# Altium project AMPURR.PrjPcb (part 1 of 2)
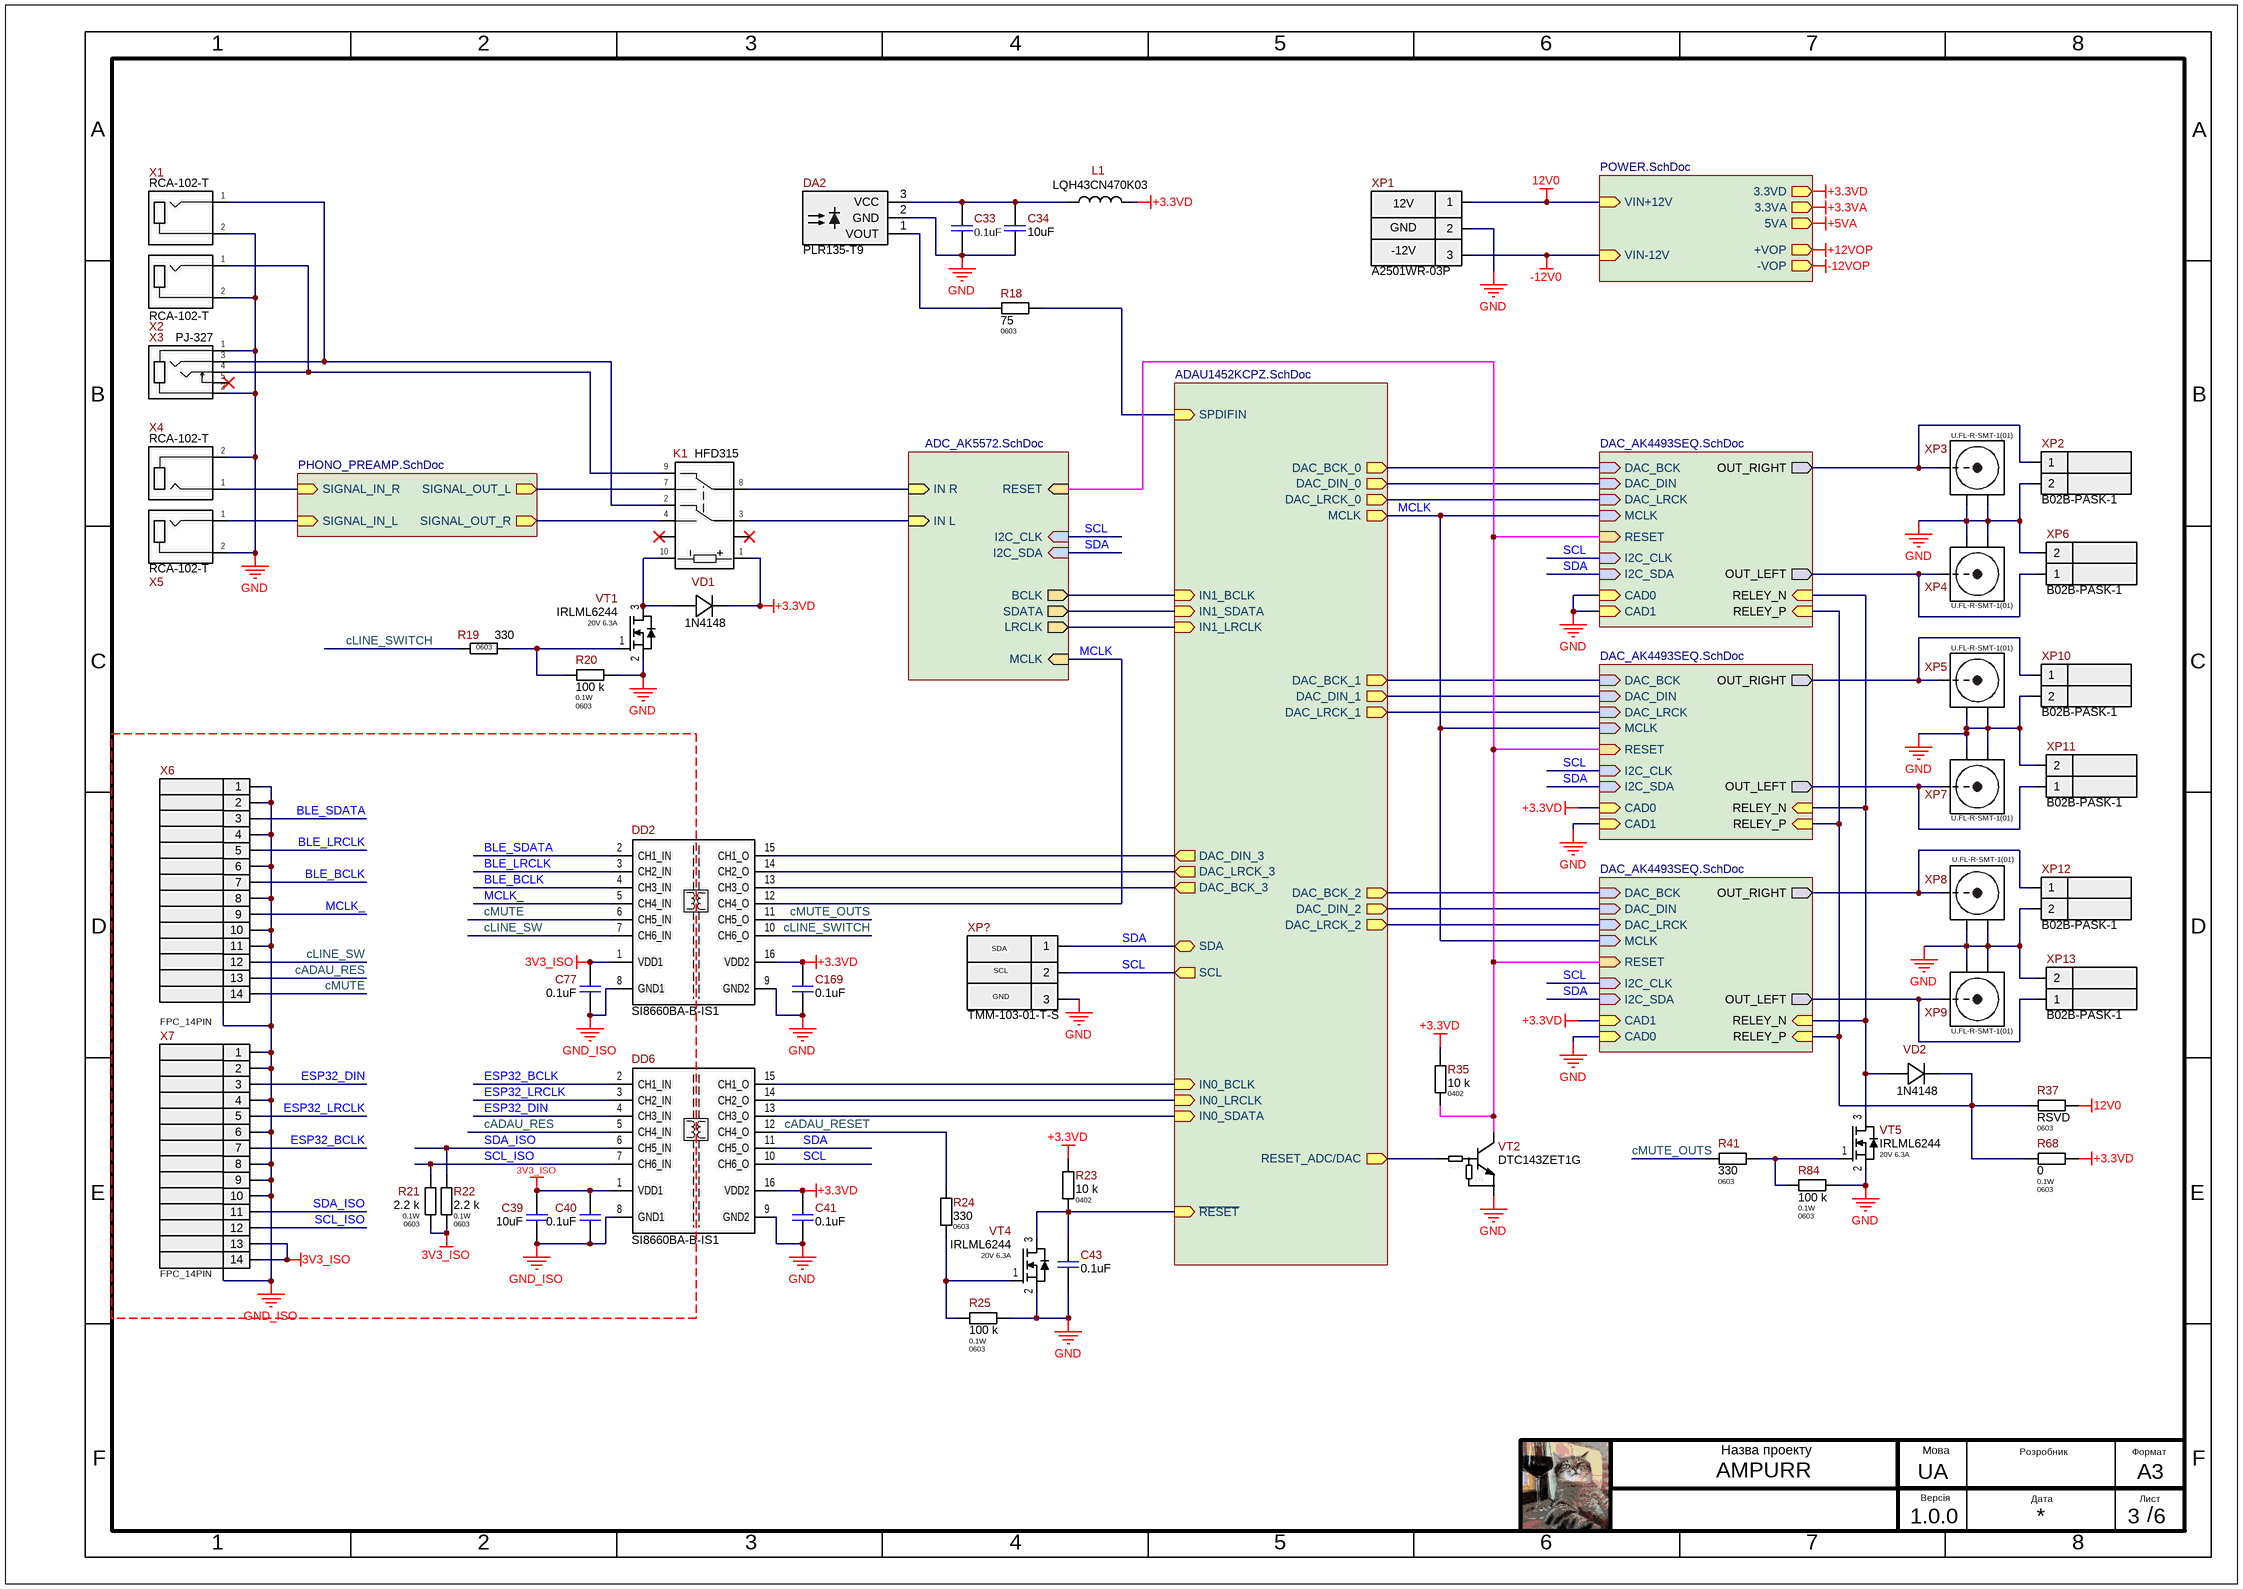
[diagram p0: AMPURR.SchDoc]
__Project_Template_Version: 1.0.3; _Amount_Boards_Per_Stand: 1; _PCB_Order_Accuracy: 0.2mm / 8mil; _PCB_Order_BoardOutlineLayer: Mechanical1 (GM1); _PCB_Order_CastellatedHolesEdges: No; _PCB_Order_Cooper: 1oz / 35um; _PCB_Order_ElectricTest: Necessarily for 100% samples; _PCB_Order_Finish: HASL; _PCB_Order_LayersCnt: 2; _PCB_Order_Mask: on both sides; _PCB_Order_MaskColor: Green / Yellow; _PCB_Order_Material: FR-4; _PCB_Order_MinHole: 0.3 mm; _PCB_Order_ProductionTime: 2 weeks; _PCB_Order_Silk: Yes; _PCB_Order_SilkColor: White; _PCB_Order_Size: 0 x 0 mm; _PCB_Order_Thickness: 1.6 mm; Authors: Kozyr.I; Product_Name: AMPURR; Project_Version: 1.0.0
6 sheets, 436 parts. Net scope: hierarchical (ports join the sheet entries above them; power ports are global).
Board file: AMPURR.PcbDoc
Sheets:
  AMPURR.SchDoc
    U_ADC_AK5572 = ADC_AK5572.SchDoc
    U_POWER = POWER.SchDoc
    U_ADAU1452KCPZ = ADAU1452KCPZ.SchDoc
    U_PHONO_PREAMP = PHONO_PREAMP.SchDoc
    U_DAC_AK4493SEQ = DAC_AK4493SEQ.SchDoc
    U_DAC_AK4493SEQ = DAC_AK4493SEQ.SchDoc
    U_DAC_AK4493SEQ = DAC_AK4493SEQ.SchDoc

## Sheet AMPURR.SchDoc: =DocumentName
size 420 x 297 mm; Author: Kozyr.I; CompanyName: "AS Manufacturing" LLC; Organization: "AS Manufacturing" LLC; Address1: 5 Sklyarenka St.; Address2: Kyiv 04073; Address3: Ukraine; Address4: https://ajax.systems/en/; DocumentNumber: 3; Revision: v1.0.0; SheetNumber: 3; SheetTotal: 6; Product name: AMPURR; Head: AMPURR..v1.0.0; PCB_Designator: AMPURR..v1.0.0; Template_version: 1.0.1

### Parts
C33  0.1uF  [C0603(1608)]
C34  10uF  [C0603(1608)]
C39  10uF  [C0402(1005)]
C40  0.1uF  [C0402(1005)]
C41  0.1uF  [C0402(1005)]
C43  0.1uF  [C0402(1005)]
C77  0.1uF  [C0402(1005)]
C169  0.1uF  [C0402(1005)]
DA2  PLR135-T9  [PLR135-T9]
DD2  SI8660BA-B-IS1  [SOIC-16]
DD6  SI8660BA-B-IS1  [SOIC-16]
K1  HFD315  [HFD315]
L1  LQH43CN470K03  [LQH43C]
R18  75  Package/Case: 0603  [R0603]
R19  330  Package/Case: 0603  [R0603]
R20  100 k  Power Rating: 0.1W  Package/Case: 0603  [R0603]
R21  2.2 k  Power Rating: 0.1W  Package/Case: 0603  [R0603]
R22  2.2 k  Power Rating: 0.1W  Package/Case: 0603  [R0603]
R23  10 k  Package/Case: 0402  [R0402]
R24  330  Package/Case: 0603  [R0603]
R25  100 k  Power Rating: 0.1W  Package/Case: 0603  [R0603]
R35  10 k  Package/Case: 0402  [R0402]
R37  RSVD  Package/Case: 0603  [R0603]  (no BOM)
R41  330  Package/Case: 0603  [R0603]
R68  0  Power Rating: 0.1W  Package/Case: 0603  [R0603]
R84  100 k  Power Rating: 0.1W  Package/Case: 0603  [R0603]
VD1  1N4148  [D0805]
VD2  1N4148  [D0805]
VT1  IRLML6244  Power Rating: 20V 6.3A  [SOT-23]
VT2  DTC143ZET1G  [SOT-416]
VT4  IRLML6244  Power Rating: 20V 6.3A  [SOT-23]
VT5  IRLML6244  Power Rating: 20V 6.3A  [SOT-23]
X1  RCA-102-T  [RCA-102-T]
X2  RCA-102-T  [RCA-102-T]
X3  PJ-327  [PJ-327A]
X4  RCA-102-T  [RCA-102-T]
X5  RCA-102-T  [RCA-102-T]
X6  FPC_14PIN  [FPC-14-0.5mm]
X7  FPC_14PIN  [FPC-14-0.5mm]
XP1  A2501WR-03P  [A2501WR-03P]
XP2  B02B-PASK-1  [JST_B02B-PASK-1(LF)(SN)]
XP3  U.FL-R-SMT-1(01)  [IPEX_ RECE.20279.001E.01]
XP4  U.FL-R-SMT-1(01)  [IPEX_ RECE.20279.001E.01]
XP5  U.FL-R-SMT-1(01)  [IPEX_ RECE.20279.001E.01]
XP6  B02B-PASK-1  [JST_B02B-PASK-1(LF)(SN)]
XP7  U.FL-R-SMT-1(01)  [IPEX_ RECE.20279.001E.01]
XP8  U.FL-R-SMT-1(01)  [IPEX_ RECE.20279.001E.01]
XP9  U.FL-R-SMT-1(01)  [IPEX_ RECE.20279.001E.01]
XP10  B02B-PASK-1  [JST_B02B-PASK-1(LF)(SN)]
XP11  B02B-PASK-1  [JST_B02B-PASK-1(LF)(SN)]
XP12  B02B-PASK-1  [JST_B02B-PASK-1(LF)(SN)]
XP13  B02B-PASK-1  [JST_B02B-PASK-1(LF)(SN)]
XP?  TMM-103-01-T-S  [CON_3_Pitch_2mm_1_Rows]

### Sub-sheets
U_ADAU1452KCPZ = ADAU1452KCPZ.SchDoc: DAC_DIN_0 (out), DAC_BCK_0 (out), DAC_LRCK_0 (out), DAC_DIN_1 (out), DAC_BCK_1 (out), DAC_LRCK_1 (out), DAC_DIN_2 (out), DAC_BCK_2 (out), DAC_LRCK_2 (out), IN0_BCLK (in), IN0_LRCLK (in), IN0_SDATA (in), IN1_BCLK (in), IN1_LRCLK (in), IN1_SDATA (in), MCLK (out), SCL (out), SDA (bidir), ~{RESET} (in), SPDIFIN (in), RESET_ADC/DAC (out), DAC_DIN_3 (out), DAC_BCK_3 (out), DAC_LRCK_3 (out)
U_ADC_AK5572 = ADC_AK5572.SchDoc: MCLK (in), IN L (in), SDATA (out), LRCLK (out), BCLK (out), IN R (in), RESET (in), I2C_SDA (in), I2C_CLK (in)
U_DAC_AK4493SEQ = DAC_AK4493SEQ.SchDoc: DAC_BCK (in), DAC_DIN (in), DAC_LRCK (in), MCLK (in), OUT_RIGHT (out), OUT_LEFT (out), RESET (in), I2C_SDA (in), I2C_CLK (in), CAD0 (in), CAD1 (in), RELEY_N (in), RELEY_P (in)
U_DAC_AK4493SEQ = DAC_AK4493SEQ.SchDoc: DAC_BCK (in), DAC_DIN (in), DAC_LRCK (in), MCLK (in), OUT_RIGHT (out), OUT_LEFT (out), RESET (in), I2C_SDA (in), I2C_CLK (in), CAD0 (in), CAD1 (in), RELEY_N (in), RELEY_P (in)
U_DAC_AK4493SEQ = DAC_AK4493SEQ.SchDoc: DAC_BCK (in), DAC_DIN (in), DAC_LRCK (in), MCLK (in), OUT_RIGHT (out), OUT_LEFT (out), RESET (in), I2C_SDA (in), I2C_CLK (in), CAD0 (in), CAD1 (in), RELEY_N (in), RELEY_P (in)
U_PHONO_PREAMP = PHONO_PREAMP.SchDoc: SIGNAL_IN_R (in), SIGNAL_OUT_R (out), SIGNAL_IN_L (in), SIGNAL_OUT_L (out)
U_POWER = POWER.SchDoc: +VOP (out), -VOP (out), 5VA (out), 3.3VA (out), 3.3VD (out), VIN+12V (in), VIN-12V (in)

### Nets
3V3_ISO: C39.2 C40.2 C77.2 DD2.1(VDD1) DD6.1(VDD1) R21.1 R22.1 X7.13 X7.14
12V0: R37.2 XP1.1 ; sheet U_POWER/VIN+12V
+3.3VD: C41.2 C169.2 DD2.16(VDD2) DD6.16(VDD2) K1.1(Coil+) L1.2 R23.2 R35.2 R68.2 VD1.1(K) ; sheet U_POWER/3.3VD, sheet U_DAC_AK4493SEQ/CAD0, sheet U_DAC_AK4493SEQ/CAD1
-12V0: XP1.3 ; sheet U_POWER/VIN-12V
GND: C33.2 C34.2 C41.1 C43.2 C169.1 DA2.2(GND) DD2.9(GND2) DD6.9(GND2) R20.1 R25.2 R84.1 VT1.2(S) VT2.2(E) VT4.2(S) VT5.2(S) X1.2(GND) X2.2(GND) X3.1(GND) X3.2(GND) X4.2(GND) X5.2(GND) XP1.2 XP2.2 XP3.2 XP3.3 XP4.2 XP4.3 XP5.2 XP5.3 XP6.2 XP7.2 XP7.3 XP8.2 XP8.3 XP9.2 XP9.3 XP10.2 XP11.2 XP12.2 XP13.2 XP?.3 ; sheet U_DAC_AK4493SEQ/CAD0, sheet U_DAC_AK4493SEQ/CAD1, sheet U_DAC_AK4493SEQ/CAD1, sheet U_DAC_AK4493SEQ/CAD0
GND_ISO: C39.1 C40.1 C77.1 DD2.8(GND1) DD6.8(GND1) X6.1 X6.2 X6.4 X6.6 X6.8 X6.10 X6.11 X6.15 X7.1 X7.2 X7.4 X7.6 X7.8 X7.9 X7.10 X7.15
BLE_BCLK: DD2.4(CH3_IN) X6.7
BLE_LRCLK: DD2.3(CH2_IN) X6.5
BLE_SDATA: DD2.2(CH1_IN) X6.3
cADAU_RES: DD6.5(CH4_IN) X6.13
cADAU_RESET: DD6.12(CH4_O) R24.2
cLINE_SW: DD2.7(CH6_IN) X6.12
cLINE_SWITCH: DD2.10(CH6_O) R19.1
cMUTE: DD2.6(CH5_IN) X6.14
cMUTE_OUTS: DD2.11(CH5_O) R41.1
DAC_BCK_0: sheet U_ADAU1452KCPZ/DAC_BCK_0, sheet U_DAC_AK4493SEQ/DAC_BCK
DAC_BCK_1: sheet U_ADAU1452KCPZ/DAC_BCK_1, sheet U_DAC_AK4493SEQ/DAC_BCK
DAC_BCK_2: sheet U_ADAU1452KCPZ/DAC_BCK_2, sheet U_DAC_AK4493SEQ/DAC_BCK
DAC_BCK_3: DD2.13(CH3_O) ; sheet U_ADAU1452KCPZ/DAC_BCK_3
DAC_DIN_0: sheet U_ADAU1452KCPZ/DAC_DIN_0, sheet U_DAC_AK4493SEQ/DAC_DIN
DAC_DIN_1: sheet U_ADAU1452KCPZ/DAC_DIN_1, sheet U_DAC_AK4493SEQ/DAC_DIN
DAC_DIN_2: sheet U_ADAU1452KCPZ/DAC_DIN_2, sheet U_DAC_AK4493SEQ/DAC_DIN
DAC_DIN_3: DD2.15(CH1_O) ; sheet U_ADAU1452KCPZ/DAC_DIN_3
DAC_LRCK_0: sheet U_ADAU1452KCPZ/DAC_LRCK_0, sheet U_DAC_AK4493SEQ/DAC_LRCK
DAC_LRCK_1: sheet U_ADAU1452KCPZ/DAC_LRCK_1, sheet U_DAC_AK4493SEQ/DAC_LRCK
DAC_LRCK_2: sheet U_ADAU1452KCPZ/DAC_LRCK_2, sheet U_DAC_AK4493SEQ/DAC_LRCK
DAC_LRCK_3: DD2.14(CH2_O) ; sheet U_ADAU1452KCPZ/DAC_LRCK_3
ESP32_BCLK: DD6.2(CH1_IN) X7.7
ESP32_DIN: DD6.4(CH3_IN) X7.3
ESP32_LRCLK: DD6.3(CH2_IN) X7.5
IN0_BCLK: DD6.15(CH1_O) ; sheet U_ADAU1452KCPZ/IN0_BCLK
IN0_LRCLK: DD6.14(CH2_O) ; sheet U_ADAU1452KCPZ/IN0_LRCLK
IN0_SDATA: DD6.13(CH3_O) ; sheet U_ADAU1452KCPZ/IN0_SDATA
IN1_BCLK: sheet U_ADC_AK5572/BCLK, sheet U_ADAU1452KCPZ/IN1_BCLK
IN1_LRCLK: sheet U_ADC_AK5572/LRCLK, sheet U_ADAU1452KCPZ/IN1_LRCLK
IN1_SDATA: sheet U_ADC_AK5572/SDATA, sheet U_ADAU1452KCPZ/IN1_SDATA
MCLK: DD2.12(CH4_O) ; sheet U_ADC_AK5572/MCLK, sheet U_ADAU1452KCPZ/MCLK, sheet U_DAC_AK4493SEQ/MCLK, sheet U_DAC_AK4493SEQ/MCLK, sheet U_DAC_AK4493SEQ/MCLK
MCLK_: DD2.5(CH4_IN) X6.9
SCL: DD6.10(CH6_O) XP?.2 ; sheet U_ADC_AK5572/I2C_CLK, sheet U_ADAU1452KCPZ/SCL, sheet U_DAC_AK4493SEQ/I2C_CLK, sheet U_DAC_AK4493SEQ/I2C_CLK, sheet U_DAC_AK4493SEQ/I2C_CLK
SCL_ISO: DD6.7(CH6_IN) R21.2 X7.12
SDA: DD6.11(CH5_O) XP?.1 ; sheet U_ADC_AK5572/I2C_SDA, sheet U_ADAU1452KCPZ/SDA, sheet U_DAC_AK4493SEQ/I2C_SDA, sheet U_DAC_AK4493SEQ/I2C_SDA, sheet U_DAC_AK4493SEQ/I2C_SDA
SDA_ISO: DD6.6(CH5_IN) R22.2 X7.11
SPDIFIN: R18.2 ; sheet U_ADAU1452KCPZ/SPDIFIN
NetC33_1: C33.1 C34.1 DA2.3(VCC) L1.1
NetC43_1: C43.1 R23.1 VT4.3(D) ; sheet U_ADAU1452KCPZ/~{RESET}
NetC86_1: K1.8(2-COM) ; sheet U_ADC_AK5572/IN R
NetC117_1: K1.3(1-COM) ; sheet U_ADC_AK5572/IN L
NetC153_2: X4.1(GND) ; sheet U_PHONO_PREAMP/SIGNAL_IN_R
NetC158_1: K1.4(1-OPEN) ; sheet U_PHONO_PREAMP/SIGNAL_OUT_R
NetC159_2: X5.1(GND) ; sheet U_PHONO_PREAMP/SIGNAL_IN_L
NetC164_1: K1.7(2-OPEN) ; sheet U_PHONO_PREAMP/SIGNAL_OUT_L
NetDA2_1: DA2.1(VOUT) R18.1
NetDD4_45: VT2.1(B) ; sheet U_ADAU1452KCPZ/RESET_ADC/DAC
NetK1_2: K1.2(1-CLOSED) X1.1(GND) X3.3(GND)
NetK1_9: K1.9(2-OPEN) X2.1(GND) X3.4(GND)
NetK1_10: K1.10(Coil-) VD1.2(A) VT1.3(D)
NetK2A_1: R37.1 R68.1 VD2.1(K) ; sheet U_DAC_AK4493SEQ/RELEY_P, sheet U_DAC_AK4493SEQ/RELEY_P, sheet U_DAC_AK4493SEQ/RELEY_P
NetK2A_3: XP4.1 XP6.1 ; sheet U_DAC_AK4493SEQ/OUT_LEFT
NetK2A_6: XP2.1 XP3.1 ; sheet U_DAC_AK4493SEQ/OUT_RIGHT
NetK2A_8: VD2.2(A) VT5.3(D) ; sheet U_DAC_AK4493SEQ/RELEY_N, sheet U_DAC_AK4493SEQ/RELEY_N, sheet U_DAC_AK4493SEQ/RELEY_N
NetK2B_3: XP7.1 XP11.1 ; sheet U_DAC_AK4493SEQ/OUT_LEFT
NetK2B_6: XP5.1 XP10.1 ; sheet U_DAC_AK4493SEQ/OUT_RIGHT
NetK2C_3: XP9.1 XP13.1 ; sheet U_DAC_AK4493SEQ/OUT_LEFT
NetK2C_6: XP8.1 XP12.1 ; sheet U_DAC_AK4493SEQ/OUT_RIGHT
NetR8A_1: R35.1 VT2.3(C) ; sheet U_ADC_AK5572/RESET, sheet U_DAC_AK4493SEQ/RESET, sheet U_DAC_AK4493SEQ/RESET, sheet U_DAC_AK4493SEQ/RESET
NetR19_2: R19.2 R20.2 VT1.1(G)
NetR24_1: R24.1 R25.1 VT4.1(G)
NetR41_2: R41.2 R84.2 VT5.1(G)

Not connected (* = marked no-connect by the designer): K1 5* 6*; X3 5(GND)*

### Notes on the sheet
- (near XP1) 12V
- (near XP1) -12V
- (near XP1) GND
- (near XP?) SDA
- (near XP?) GND
- (near XP?) SCL
- 1
- 2
- 3
- 4
- 5
- 6
- 7
- 8
- A
- B
- C
- D
- E
- F
- Назва проекту
- Мова
- UA
- Розробник
- Формат
- A3
- Версія
- Дата
- Лист
- /
- (in symbol DTC143ZET1G) 4.7k; 47k

### Library data of the parts
C33 = 0.1uF  50V C0603: CAP CER 0.1UF 50V X7R 0603; Manufacturer: Samsung Electro-Mechanics; Manufacturer P/N: CL10B104KB8WPNC; Name Component: Capacitor Ceramic; Tolerance: ±10%; Operation Temperature: -55°C ~ 125°C; Library Path 1: Capacitors.SchLib; Notes: 06035C104K4T4A, 06035C104K4T2A; Part Number: 0.1uF  50V C0603; Value: 0.1uF; Temperature Coefficient: X7R; Power (V/A): 50V; Package/Case: C0603; Supplier Part Number 1: 1276-6854-2-ND; ComponentLink1Description: Datasheet; Supplier 1: Digi-key; ComponentLink1URL: https://www.samsungsem.com/resources/file/global/support/product_catalog/MLCC.pdf
C34 = 10uF  35V C0603: CAP CER 10UF 35V X5R 0603; Manufacturer: Murata Electronics North America; Manufacturer P/N: GRM188R6YA106MA73D; Name Component: Capacitor Ceramic; Tolerance: ±20%; Operation Temperature: -55°C ~ 105°C; Library Path 1: Capacitors.SchLib; Part Number: 10uF  35V C0603; Value: 10uF; Temperature Coefficient: X5R; Power (V/A): 35V; Package/Case: C0603; Supplier Part Number 1: 490-13248-2-ND; ComponentLink1Description: Datasheet; Supplier 1: Digi-key; ComponentLink1URL: https://search.murata.co.jp/Ceramy/image/img/A01X/G101/ENG/GRM188R6YA106MA73-01.pdf
C39 = 10uF  6.3V C0402: CAP CER 10UF 6.3V X6S 0402; Manufacturer: Murata Electronics North America; Manufacturer P/N: GRM155C80J106ME11D; Name Component: Capacitor Ceramic; Tolerance: ±20%; Operation Temperature: -55°C ~ 105°C; Library Path 1: Capacitors.SchLib; Part Number: 10uF  6.3V C0402; Value: 10uF; Temperature Coefficient: X6S; Power (V/A): 6.3V; Package/Case: C0402; Supplier 1: Digi-key; Supplier Part Number 1: 490-13233-2-ND; ComponentLink1Description: Datasheet; ComponentLink1URL: https://www.murata.com/~/media/webrenewal/support/library/catalog/products/capacitor/mlcc/c02e.ashx?la=en-us
C40 C41 C43 C77 C169 = 0.1uF  25V C0403: CAP CER 0.1UF 25V X7R 0603; Manufacturer: Samsung Electro-Mechanics; Name Component: Capacitor Ceramic; Tolerance: ±10%; Operation Temperature: -55°C ~ 125°C; Library Path 1: Capacitors.SchLib; Part Number: 0.1uF  25V C0403; Value: 0.1uF; Temperature Coefficient: X7R; Power (V/A): 25V; Package/Case: C0403; Supplier Part Number 1: 1276-6854-2-ND; ComponentLink1Description: Datasheet
DA2 = PLR135-T9: Fiber Optic Receiver General Data Transfer 16Mbps -27dBm 2.4V ~ 5.5V 12 mA; Manufacturer: Everlight Electronics Co Ltd; Name Component: Fiber Optic Receivers; Library Path 1: Opto.SchLib; Part Number: PLR135-T9; Value: PLR135-T9; Power (V/A): 2.4V ~ 5.5V; Package/Case: PLR135; Manufacturer P/N: PLR135-T9; Supplier 1: Digi-key; ComponentLink1Description: Datasheet; ComponentLink1URL: https://mm.digikey.com/Volume0/opasdata/d220001/medias/docus/6601/PLR135_T9.pdf
DD2 DD6 = SI8660BA-B-IS1: General Purpose Digital Isolator 1000Vrms 6 Channel 150Mbps 35kV/µs CMTI 16-SOIC (0.154", 3.90mm Width); Manufacturer: Skyworks Solutions Inc.; Name Component: ISOLATOR I2S; Operation Temperature: -40°C ~ 125°C; Power (V/A): 2.5V ~ 5.5V; Library Path 1: Integrated Circuit.SchLib; Part Number: SI8660BA-B-IS1; Value: SI8660BA-B-IS1; Package/Case: 16-SOIC; Manufacturer P/N: SI8660BA-B-IS1; Supplier 1: Digi-key; Supplier Part Number 1: 336-2115-5-ND; ComponentLink1Description: Datasheet; ComponentLink1URL: https://eu.mouser.com/datasheet/2/472/si866x-2507613.pdf
K1 = HFD315: Signal Relay 5VDC 2A DPDT(14x9x5.4)mm THT; Manufacturer_Name: Hongfa; Manufacturer_Part_Number: HFD31/5; Power (V/A): 2A 30V; Library Path 1: Others.SchLib; Datasheet Link: https://source.hongfa.com//Api/DownloadPdf/152; Height: 5.4mm; Arrow Part Number: HFD31/5; Arrow Price/Stock: https://www.arrow.com/en/products/hfd315/hongfa-europe-gmbh?region=europe; Part Number: HFD315; Name Component: Relay; Value: HFD315; Manufacturer: HONGFA; Supplier 1: RCS; ComponentLink1Description: Datasheet; ComponentLink1URL: https://static6.arrow.com/aropdfconversion/b1e7c006847c6f4b4ecbb9dbc4d2a4bf4dbb2da6/hfd31.pdf
L1 = LQH43CN470K03: FIXED IND 47UH 280MA 1.1 OHM SMD; Manufacturer: MurataElectronics; Manufacturer P/N: LQH43CN470K03L; Name Component: Fixed Inductors; Tolerance: ±10; Operation Temperature: -40°C ~ 85°C; Library Path 1: Inductance.SchLib; Power (V/A): 0.28 A; Part Number: LQH43CN470K03; Value: LQH43CN470K03; Supplier 1: Digi-key; Supplier Part Number 1: 490-2521-2-ND; ComponentLink1Description: Datasheet; ComponentLink1URL: https://search.murata.co.jp/Ceramy/image/img/P02/JELF243A-0042.pdf
R18 = 10 k  R0603: RES SMD 10 k OHM  ±1% 1/10W 0603; Power Rating: 0.1W; Name Component: Resistror; Value: 10 k; Operation Temperature: -55℃ to 155℃; Temperature Coefficient: ±100 ppm/°C; Library Path 1: Resistor.SchLib; Part Number: 10 k  R0603; Tolerance: ±1%
R19 R24 R41 = 330  R0603: RES SMD 330 OHM  ±1% 1/10W 0603; Power Rating: 0.1W; Name Component: Resistror; Operation Temperature: -55℃ to 155℃; Temperature Coefficient: ±100 ppm/°C; Library Path 1: Resistor.SchLib; Part Number: 330  R0603; Value: 330; Tolerance: ±1%
R20 R25 R84 = 100 k  R0603: RES SMD 100 k OHM  ±1% 1/10W 0603; Name Component: Resistror; Operation Temperature: -55℃ to 155℃; Temperature Coefficient: ±100 ppm/°C; Library Path 1: Resistor.SchLib; Part Number: 100 k  R0603; Value: 100 k; Tolerance: ±1%
R21 R22 = 2.2 k  R0603: RES SMD 2.2 k OHM  ±1% 1/10W 0603; Name Component: Resistror; Operation Temperature: -55℃ to 155℃; Temperature Coefficient: ±100 ppm/°C; Library Path 1: Resistor.SchLib; Part Number: 2.2 k  R0603; Value: 2.2 k; Tolerance: ±1%
R23 R35 = 10 k  R0402: RES SMD 10 k OHM  ±1% 1/16W 0402; Power Rating: 0.063W; Name Component: Resistror; Operation Temperature: -55℃ to 155℃; Temperature Coefficient: ±100 ppm/°C; Library Path 1: Resistor.SchLib; Part Number: 10 k  R0402; Value: 10 k; Tolerance: ±1%
R37 = RSVD  R0603: RES SMD RSVD OHM  NC 1/16W 0402; Name Component: Resistror; Operation Temperature: -55℃ to 155℃; Temperature Coefficient: ±200 ppm/°C; Library Path 1: Resistor.SchLib; Part Number: RSVD  R0603; Value: RSVD; Tolerance: NC
R68 = 0  R0603: RES SMD 0 OHM  ±1% 1/10W 0603; Part Number: 0  R0603; Name Component: Resistror; Operation Temperature: -55℃ to 155℃; Temperature Coefficient: ±200 ppm/°C; Library Path 1: Resistor.SchLib; Value: 0; Tolerance: ±1%
VD1 VD2 = 1N4148: DIODE GEN PURP 75V 250MA SOD323; Manufacturer: Diodes Incorporated; Operation Temperature: -55°C ~ 150°C; Library Path 1: Diodes.SchLib; Power Rating: 75V 250mA; Part Number: 1N4148; Name Component: Diode; Value: 1N4148; Package/Case: SOD-80; Manufacturer P/N: 1N4148; Supplier 1: Digi-key; Supplier Part Number 1: 1N4148; ComponentLink1Description: Datasheet
VT1 VT4 VT5 = IRLML6244: MOSFET N-CH 20V 6.3A SOT-23; Manufacturer: InfineonTechnologies; Manufacturer P/N: IRLML6244TRPBF; Name Component: Transistor; Operation Temperature: -55°C ~ 150°C (TJ); Library Path 1: Transistors.SchLib; ComponentLink1URL: https://www.infineon.com/dgdl/irlml6244pbf.pdf?fileId=5546d462533600a4015356686fed261f; ComponentLink1Description: Datasheet; Part Number: IRLML6244; Value: IRLML6244; Package/Case: SOT-23; Supplier 1: Digi-key; Supplier Part Number 1: IRLML6244TRPBFTR-ND
VT2 = DTC143ZET1G: TRANS PREBIAS NPN 50V 100MA SC75; Manufacturer: onsemi; Name Component: Transistor; Operation Temperature: -55°C ~ 150°C (TJ); Power Rating: 100mA 50V; Library Path 1: Transistors.SchLib; Part Number: DTC143ZET1G; Value: DTC143ZET1G; Package/Case: SOT-416; Manufacturer P/N: DTC143ZET1G; Supplier 1: Digi-key; Supplier Part Number 1: DTC143ZET1GOSTR-ND; ComponentLink1Description: Datasheet; ComponentLink1URL: https://www.onsemi.com/pdf/datasheet/dtc143z-d.pdf
X1 X2 X4 X5 = RCA-102-T: Name Component: RSA; Library Path 1: Connectors.SchLib; Part Number: RCA-102-T; Value: RCA-102-T; Supplier 1: Kosmodrom; ComponentLink1Description: Datasheet; ComponentLink1URL: http://www.kosmodrom.com.ua/pdf/RCA-102.pdf
X3 = PJ-327: 3.5 Audio Jack SMD; Manufacturer_Name: Hongfa; Manufacturer_Part_Number: HFD31/5; Library Path 1: Connectors.SchLib; Datasheet Link: https://source.hongfa.com//Api/DownloadPdf/152; Height: 5.4mm; Arrow Part Number: HFD31/5; Arrow Price/Stock: https://www.arrow.com/en/products/hfd315/hongfa-europe-gmbh?region=europe; Part Number: PJ-327; Name Component: Audio Jack; Value: PJ-327; Supplier 1: Kosmodrom; ComponentLink1Description: Datasheet; ComponentLink1URL: https://e2e.ti.com/cfs-file/__key/communityserver-discussions-components-files/6/2.5_2D00_3.5_2D00_phone_2D00_jack.pdf
X6 X7 = FPC_14PIN: FPC CONNECTOR; Library Path 1: Connectors.SchLib; Part Number: FPC_14PIN; Name Component: FPC_14PIN; Value: FPC_14PIN; ComponentLink1Description: Datasheet
XP1 = A2501WR-03P: PIN: 3; A2501; 3A; 250V; UL94V-0; Manufacturer: JOINT TECH; Name Component: Power Connectors; Operation Temperature: -40°C ~ 80°C; Library Path 1: Connectors.SchLib; Part Number: A2501WR-03P; Value: A2501WR-03P; Supplier 1: RCS; ComponentLink1Description: Datasheet; ComponentLink1URL: https://documents.tme.eu/v7/_solaris-tep_/pVersion=0046&contRep=ZT&docId=005056AB752F1EE383C6617DFE942CAD&compId=A2501WV-XP.pdf?ci_sign=9baf55e1d4ede3a69cd97522aa56fece6c405150
XP2 XP6 XP10-XP13 = B02B-PASK-1: CONN HEADER VERT 2POS 2MM; Manufacturer: JST Sales America Inc.; Manufacturer P/N: B02B-PASK-1(LF)(SN); Name Component: Rectangular Connectors - Headers; Operation Temperature: -55 °C to +105 °C; Power (V/A): 3A; Library Path 1: Connectors.SchLib; Part Number: B02B-PASK-1; Value: B02B-PASK-1; Package/Case: 2mm; Supplier 1: Digi-key; ComponentLink1Description: Datasheet; ComponentLink1URL: http://www.jst-mfg.com/product/pdf/eng/ePA-F.pdf
XP3-XP5 XP7-XP9 = U.FL-R-SMT-1(01): CONN UMC RCPT STR 50 OHM SMD; Manufacturer: HIROSE; Name Component: U.FL (IPX/AMC); Operation Temperature: -10°C …. 40°C; Library Path 1: Connectors.SchLib; System: Connector; Part Number: U.FL-R-SMT-1(01); Value: U.FL-R-SMT-1(01); Package/Case: Male Pin; Manufacturer P/N: U.FL-R-SMT-1(01); Supplier 1: TME; ComponentLink1Description: Datasheet; ComponentLink1URL: https://www.tme.eu/ua/ru/details/u.fl-r-smt-1-01/mikrorazemy/hirose/u-fl-r-smt-1-01/
XP? = TMM-103-01-T-S: CONN HEADER VERT 3POS 2MM; Manufacturer: Samtec Inc.; Name Component: Rectangular Connectors - Headers; Operation Temperature: -55 °C to +105 °C; Power (V/A): 3.2A; Library Path 1: Connectors.SchLib; Part Number: TMM-103-01-T-S; Value: TMM-103-01-T-S; Package/Case: 2mm; Manufacturer P/N: TMM-103-01-T-S; Supplier 1: Digi-key; ComponentLink1Description: Datasheet; ComponentLink1URL: http://suddendocs.samtec.com/catalog_english/tmm_th.pdf

## Sheet ADC_AK5572.SchDoc: =DocumentName
size 420 x 297 mm; Author: Kozyr.I; CompanyName: "AS Manufacturing" LLC; Organization: "AS Manufacturing" LLC; Address1: 5 Sklyarenka St.; Address2: Kyiv 04073; Address3: Ukraine; Address4: https://ajax.systems/en/; DocumentNumber: 2; Revision: v1.0.0; SheetNumber: 2; SheetTotal: 6; Product name: AMPURR; Head: AMPURR..v1.0.0; PCB_Designator: AMPURR..v1.0.0; Template_version: 1.0.1
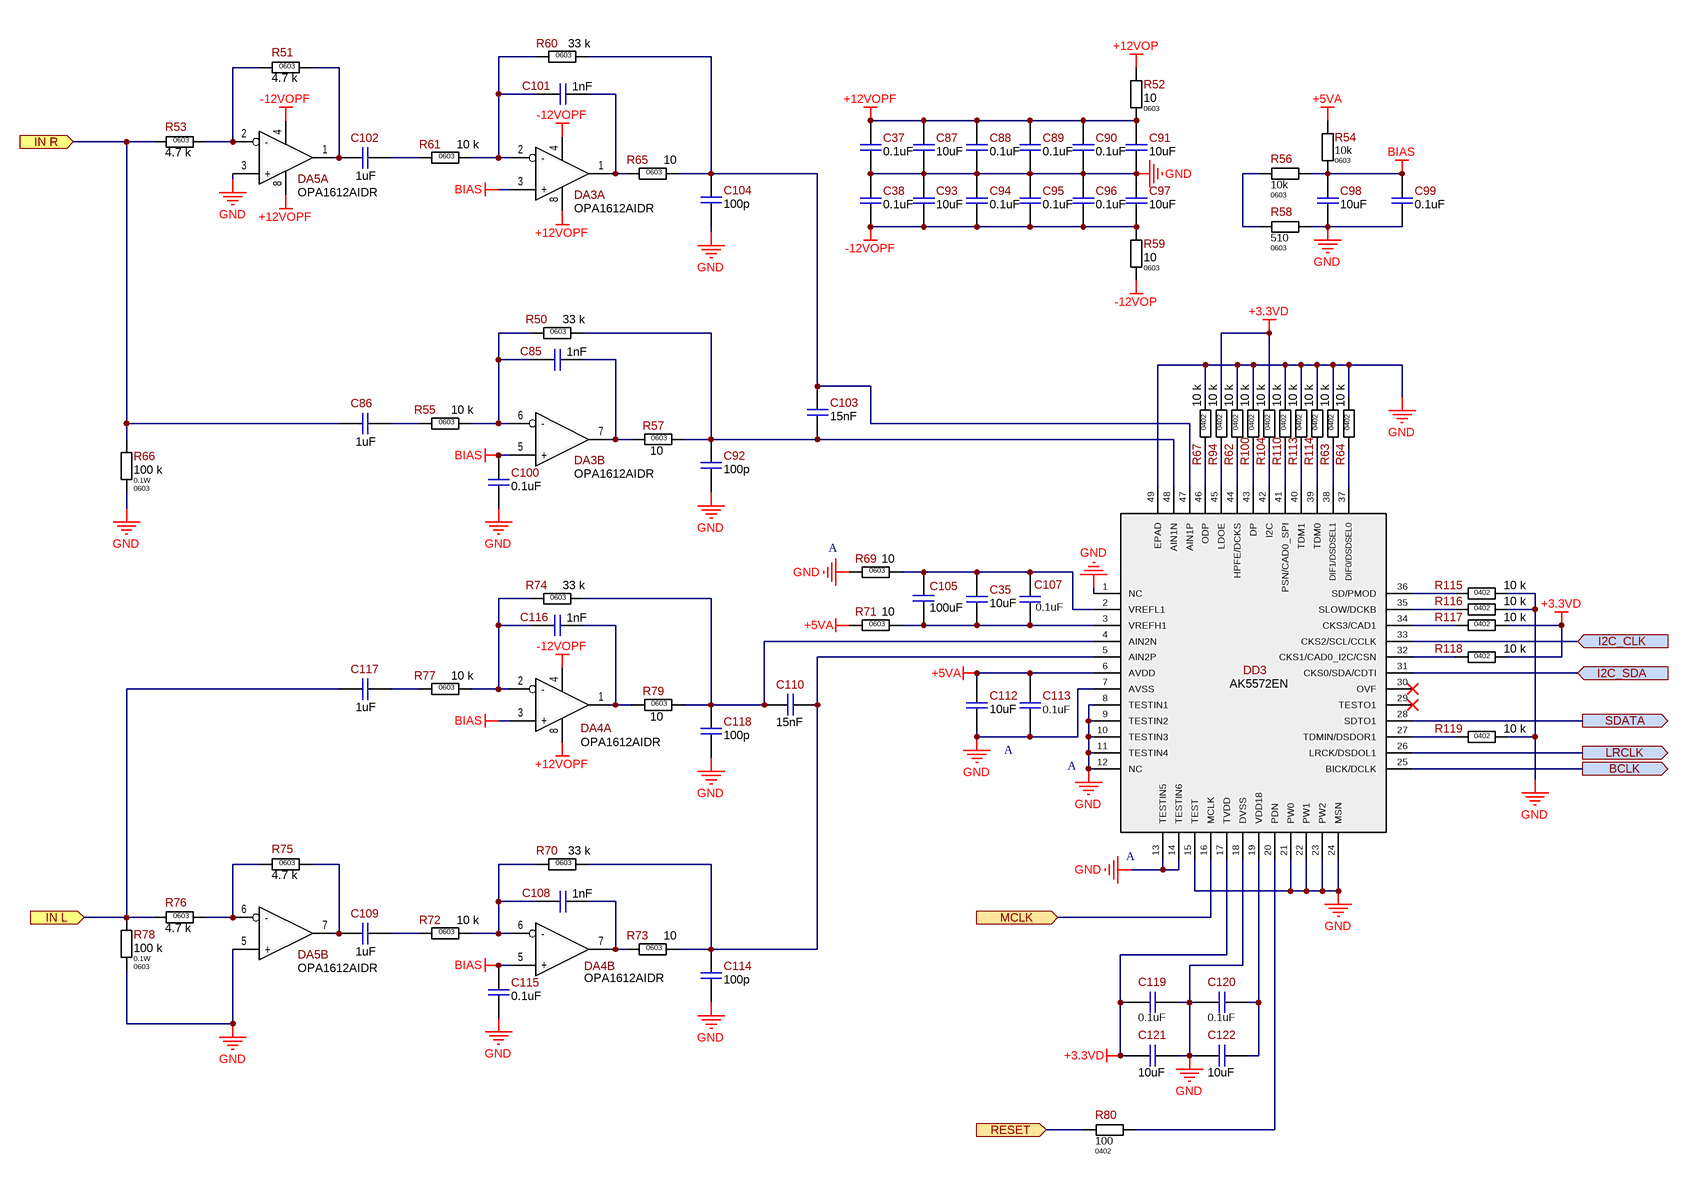
[diagram p1: ADC_AK5572.SchDoc]

### Parts
C35  10uF  [C0402(1005)]
C37  0.1uF  [C0603(1608)]
C38  0.1uF  [C0603(1608)]
C85  1nF  [C0603(1608)]
C86  1uF  [WIMA5]
C87  10uF  [C0603(1608)]
C88  0.1uF  [C0603(1608)]
C89  0.1uF  [C0603(1608)]
C90  0.1uF  [C0603(1608)]
C91  10uF  [C0603(1608)]
C92  100p  [C0603(1608)]
C93  10uF  [C0603(1608)]
C94  0.1uF  [C0603(1608)]
C95  0.1uF  [C0603(1608)]
C96  0.1uF  [C0603(1608)]
C97  10uF  [C0603(1608)]
C98  10uF  [C0603(1608)]
C99  0.1uF  [C0603(1608)]
C100  0.1uF  [C0603(1608)]
C101  1nF  [C0603(1608)]
C102  1uF  [WIMA5]
C103  15nF  [C0402(1005)]
C104  100p  [C0603(1608)]
C105  100uF  [C1206(3216)]
C107  0.1uF  [C0402(1005)]
C108  1nF  [C0603(1608)]
C109  1uF  [WIMA5]
C110  15nF  [C0402(1005)]
C112  10uF  [C0402(1005)]
C113  0.1uF  [C0402(1005)]
C114  100p  [C0603(1608)]
C115  0.1uF  [C0603(1608)]
C116  1nF  [C0603(1608)]
C117  1uF  [WIMA5]
C118  100p  [C0603(1608)]
C119  0.1uF  [C0402(1005)]
C120  0.1uF  [C0402(1005)]
C121  10uF  [C0402(1005)]
C122  10uF  [C0402(1005)]
DA3  OPA1612AIDR  [SOIC8]  (parts A,B of 2)
DA4  OPA1612AIDR  [SOIC8]  (parts A,B of 2)
DA5  OPA1612AIDR  [SOIC8]  (parts A,B of 2)
DD3  AK5572EN  [QFN50P700X700X60-49N]
R50  33 k  Package/Case: 0603  [R0603]
R51  4.7 k  Package/Case: 0603  [R0603]
R52  10  Package/Case: 0603  [R0603]
R53  4.7 k  Package/Case: 0603  [R0603]
R54  10k  Package/Case: 0603  [R0603]
R55  10 k  Package/Case: 0603  [R0603]
R56  10k  Package/Case: 0603  [R0603]
R57  10  Package/Case: 0603  [R0603]
R58  510  Package/Case: 0603  [R0603]
R59  10  Package/Case: 0603  [R0603]
R60  33 k  Package/Case: 0603  [R0603]
R61  10 k  Package/Case: 0603  [R0603]
R62  10 k  Package/Case: 0402  [R0402]
R63  10 k  Package/Case: 0402  [R0402]
R64  10 k  Package/Case: 0402  [R0402]
R65  10  Package/Case: 0603  [R0603]
R66  100 k  Power Rating: 0.1W  Package/Case: 0603  [R0603]
R67  10 k  Package/Case: 0402  [R0402]
R69  10  Package/Case: 0603  [R0603]
R70  33 k  Package/Case: 0603  [R0603]
R71  10  Package/Case: 0603  [R0603]
R72  10 k  Package/Case: 0603  [R0603]
R73  10  Package/Case: 0603  [R0603]
R74  33 k  Package/Case: 0603  [R0603]
R75  4.7 k  Package/Case: 0603  [R0603]
R76  4.7 k  Package/Case: 0603  [R0603]
R77  10 k  Package/Case: 0603  [R0603]
R78  100 k  Power Rating: 0.1W  Package/Case: 0603  [R0603]
R79  10  Package/Case: 0603  [R0603]
R80  100  Package/Case: 0402  [R0402]
R94  10 k  Package/Case: 0402  [R0402]
R100  10 k  Package/Case: 0402  [R0402]
R104  10 k  Package/Case: 0402  [R0402]
R110  10 k  Package/Case: 0402  [R0402]
R113  10 k  Package/Case: 0402  [R0402]
R114  10 k  Package/Case: 0402  [R0402]
R115  10 k  Package/Case: 0402  [R0402]
R116  10 k  Package/Case: 0402  [R0402]
R117  10 k  Package/Case: 0402  [R0402]
R118  10 k  Package/Case: 0402  [R0402]
R119  10 k  Package/Case: 0402  [R0402]

### Ports
BCLK (out), I2C_CLK (in), I2C_SDA (in), IN L (in), IN R (in), LRCLK (out), MCLK (in), RESET (in), SDATA (out)

### Nets
+3.3VD: C119.2 C121.2 DD3.17(TVDD) R94.2 R104.2 R117.1 R118.1
+5VA: C112.2 C113.2 DD3.6(AVDD) R54.1 R71.2
+12VOP: R52.1
+12VOPF: C37.2 C87.2 C88.2 C89.2 C90.2 C91.2 DA3.8(V+) DA4.8(V+) DA5.8(V+) R52.2
-12VOP: R59.2
-12VOPF: C38.1 C93.1 C94.1 C95.1 C96.1 C97.1 DA3.4(V-) DA4.4(V-) DA5.4(V-) R59.1
BIAS: C98.2 C99.2 C100.2 C115.2 DA3.3(+) DA3.5(+) DA4.3(+) DA4.5(+) R54.2 R56.2
GND: C37.1 C38.2 C87.1 C88.1 C89.1 C90.1 C91.1 C92.2 C93.2 C94.2 C95.2 C96.2 C97.2 C98.1 C99.1 C100.1 C104.2 C112.1 C113.1 C114.2 C115.1 C118.2 C119.1 C120.2 C121.1 C122.2 DA5.3(+) DA5.5(+) DD3.1(NC) DD3.7(AVSS) DD3.8(TESTIN1) DD3.9(TESTIN2) DD3.10(TESTIN3) DD3.11(TESTIN4) DD3.12(NC) DD3.13(TESTIN5) DD3.14(TESTIN6) DD3.15(TEST) DD3.18(DVSS) DD3.21(PW0) DD3.22(PW1) DD3.23(PW2) DD3.24(MSN) DD3.49(EPAD) R58.2 R62.2 R63.2 R64.2 R66.1 R67.2 R69.2 R78.1 R100.2 R110.2 R113.2 R114.2 R115.1 R116.1 R119.1
IN1_BCLK: DD3.25(BICK/DCLK) ; port BCLK
IN1_LRCLK: DD3.26(LRCK/DSDOL1) ; port LRCLK
IN1_SDATA: DD3.28(SDTO1) ; port SDATA
MCLK: DD3.16(MCLK) ; port MCLK
SCL: DD3.33(CKS2/SCL/CCLK) ; port I2C_CLK
SDA: DD3.31(CKS0/SDA/CDTI) ; port I2C_SDA
NetC35_1: C35.1 C105.2 C107.1 DD3.3(VREFH1) R71.1
NetC35_2: C35.2 C105.1 C107.2 DD3.2(VREFL1) R69.1
NetC85_1: C85.1 DA3.7(Out) R57.2
NetC85_2: C85.2 DA3.6(-) R50.2 R55.1
NetC86_1: C86.1 R53.2 R66.2 ; port IN R
NetC86_2: C86.2 R55.2
NetC92_1: C92.1 C103.2 DD3.48(AIN1N) R50.1 R57.1
NetC101_1: C101.1 DA3.1(Out) R65.2
NetC101_2: C101.2 DA3.2(-) R60.2 R61.1
NetC102_1: C102.1 DA5.1(Out) R51.1
NetC102_2: C102.2 R61.2
NetC103_1: C103.1 C104.1 DD3.47(AIN1P) R60.1 R65.1
NetC108_1: C108.1 DA4.7(Out) R73.2
NetC108_2: C108.2 DA4.6(-) R70.2 R72.1
NetC109_1: C109.1 DA5.7(Out) R75.1
NetC109_2: C109.2 R72.2
NetC110_1: C110.1 C118.1 DD3.4(AIN2N) R74.1 R79.1
NetC110_2: C110.2 C114.1 DD3.5(AIN2P) R70.1 R73.1
NetC116_1: C116.1 DA4.1(Out) R79.2
NetC116_2: C116.2 DA4.2(-) R74.2 R77.1
NetC117_1: C117.1 R76.2 R78.2 ; port IN L
NetC117_2: C117.2 R77.2
NetC120_1: C120.1 C122.1 DD3.19(VDD18)
NetDA5_2: DA5.2(-) R51.2 R53.1
NetDA5_6: DA5.6(-) R75.2 R76.1
NetDD3_20: DD3.20(PDN) R80.2
NetDD3_27: DD3.27(TDMIN/DSDOR1) R119.2
NetDD3_32: DD3.32(CKS1/CAD0_I2C/CSN) R118.2
NetDD3_34: DD3.34(CKS3/CAD1) R117.2
NetDD3_35: DD3.35(SLOW/DCKB) R116.2
NetDD3_36: DD3.36(SD/PMOD) R115.2
NetDD3_37: DD3.37(DIF0/DSDSEL0) R64.1
NetDD3_38: DD3.38(DIF1/DSDSEL1) R63.1
NetDD3_39: DD3.39(TDM0) R114.1
NetDD3_40: DD3.40(TDM1) R113.1
NetDD3_41: DD3.41(PSN/CAD0_SPI) R110.1
NetDD3_42: DD3.42(I2C) R104.1
NetDD3_43: DD3.43(DP) R100.1
NetDD3_44: DD3.44(HPFE/DCKS) R62.1
NetDD3_45: DD3.45(LDOE) R94.1
NetDD3_46: DD3.46(ODP) R67.1
NetR8A_1: R80.1 ; port RESET
NetR56_1: R56.1 R58.1

Not connected (* = marked no-connect by the designer): DD3 29(TESTO1)* 30(OVF)*

### Notes on the sheet
- (near R69) A
- (near DD3) PCM Mode
- A
- (near DD3) A
- 1
- 2
- 3
- 4
- 5
- 6
- 7
- 8
- B
- C
- D
- E
- F
- Назва проекту
- Мова
- UA
- Розробник
- Формат
- A3
- Версія
- Дата
- Лист
- /

### Library data of the parts
C35 C112 C121 C122 = 10uF  6.3V C0402: as C39 on sheet AMPURR; Part Number: 10uF  6.3V C0402; Value: 10uF; Temperature Coefficient: X6S; Power (V/A): 6.3V; Package/Case: C0402; Supplier 1: Digi-key; Supplier Part Number 1: 490-13233-2-ND; ComponentLink1Description: Datasheet; ComponentLink1URL: https://www.murata.com/~/media/webrenewal/support/library/catalog/products/capacitor/mlcc/c02e.ashx?la=en-us
C37 C38 C88-C90 C94-C96 C99 C100 C115 = 0.1uF  50V C0603: as C33 on sheet AMPURR; Part Number: 0.1uF  50V C0603; Value: 0.1uF; Temperature Coefficient: X7R; Power (V/A): 50V; Package/Case: C0603; Supplier Part Number 1: 1276-6854-2-ND; ComponentLink1Description: Datasheet; Supplier 1: Digi-key; ComponentLink1URL: https://www.samsungsem.com/resources/file/global/support/product_catalog/MLCC.pdf
C85 C101 C108 C116 = 1nF  25V C0603: CAP CER 1nF 25V X7R 0603; Manufacturer: AVX Corporation; Manufacturer P/N: 06033C102KAT2A; Name Component: Capacitor Ceramic; Tolerance: ±10%; Operation Temperature: -55°C ~ 105°C; Notes: 06033C102KAT4A, 06033C102KAJ2A; Library Path 1: Capacitors.SchLib; Part Number: 1nF  25V C0603; Value: 1nF; Temperature Coefficient: X7R; Power (V/A): 25V; Package/Case: C0603; Supplier 1: Digi-key; Supplier Part Number 1: 478-11809-2-ND; ComponentLink1Description: Datasheet; ComponentLink1URL: http://catalogs.avx.com/SurfaceMount.pdf
C86 C102 C109 C117 = 1uF  30В AC, 50В DC 5.5x10x7, 2мм: CAP FILM 1UF 10% 100VDC; Manufacturer: WIMA; Manufacturer P/N: MKS2B042201F00; Name Component: Polypropylene (PP), Metallized; Operation Temperature: -55°C ~ 125°C; Library Path 1: Capacitors.SchLib; Part Number: 1uF  30В AC, 50В DC 5.5x10x7, 2мм; Value: 1uF; Tolerance: ±10%; Power (V/A): 30В AC, 50В DC; Package/Case: 5.5x10x7, 2мм; Supplier 1: kosmodrom; ComponentLink1Description: Datasheet
C87 C91 C93 C97 C98 = 10uF  35V C0603: as C34 on sheet AMPURR; Part Number: 10uF  35V C0603; Value: 10uF; Temperature Coefficient: X5R; Power (V/A): 35V; Package/Case: C0603; Supplier 1: Digi-key; Supplier Part Number 1: 490-13248-2-ND; ComponentLink1Description: Datasheet; ComponentLink1URL: https://search.murata.co.jp/Ceramy/image/img/A01X/G101/ENG/GRM188R6YA106MA73-01.pdf
C92 C104 C114 C118 = 0.1uF  50V C0603: CAP CER 0.1UF 50V X7R 0603; Manufacturer: Samsung Electro-Mechanics; Manufacturer P/N: CL10B104KB8WPNC; Name Component: Capacitor Ceramic; Tolerance: ±10%; Operation Temperature: -55°C ~ 125°C; Notes: 06035C104K4T4A, 06035C104K4T2A; Library Path 1: Capacitors.SchLib; Part Number: 0.1uF  50V C0603; Value: 0.1uF; Temperature Coefficient: X7R; Power (V/A): 50V; Package/Case: C0603; Supplier 1: Digi-key; Supplier Part Number 1: 1276-6854-2-ND; ComponentLink1Description: Datasheet; ComponentLink1URL: https://www.samsungsem.com/resources/file/global/support/product_catalog/MLCC.pdf
C103 C110 = 15nF  25V C0402: CAP CER NPO 15nF 25V; Manufacturer: Samsung Electro-Mechanics; Name Component: Capacitor Ceramic; Tolerance: 10%; Operation Temperature: -55°C ~ 85°C; Temperature Coefficient: C0G, NP0; Library Path 1: Capacitors.SchLib; Part Number: 15nF  25V C0402; Value: 15nF; Power (V/A): 25V; Package/Case: C0402; Supplier 1: Digi-key; ComponentLink1Description: Datasheet; ComponentLink1URL: https://www.samsungsem.com/resources/file/global/support/product_catalog/MLCC.pdf
C105 = 100uF  10V С1206: CAP CER 100UF 10V X5T 1206; Name Component: Capacitor Ceramic; Tolerance: ±20%; Operation Temperature: -55°C ~ 105°C; Temperature Coefficient: X5R; Library Path 1: Capacitors.SchLib; Part Number: 100uF  10V С1206; Value: 100uF; Power (V/A): 10V; Package/Case: С1206; Supplier 1: Digi-key; ComponentLink1Description: Datasheet
C107 C113 C119 C120 = 0.1uF  25V C0403: as C40 on sheet AMPURR; Part Number: 0.1uF  25V C0403; Value: 0.1uF; Temperature Coefficient: X7R; Power (V/A): 25V; Package/Case: C0403; Supplier Part Number 1: 1276-6854-2-ND; ComponentLink1Description: Datasheet
DA3-DA5 = OPA1612AIDR: Audio Amplifier 2 Circuit Rail-to-Rail 8-SOIC; Manufacturer: Texas Instruments; Name Component: Operational amplifier; Operation Temperature: -40°C ~ 85°C; Power (V/A): 4.5V-36; Library Path 1: Integrated Circuit.SchLib; ComponentLink1URL: https://www.ti.com/general/docs/suppproductinfo.tsp?distId=10&gotoUrl=https%3A%2F%2Fwww.ti.com%2Flit%2Fgpn%2Fopa1611; ComponentLink1Description: Datasheet; Part Number: OPA1612AIDR; Value: OPA1612AIDR; Package/Case: 8-SOIC; Manufacturer P/N: OPA1612AIDR; Supplier 1: Digi-key; Supplier Part Number 1: 296-39098-6-ND
DD3 = AK5572EN: ADC, Audio 32 b 768k DSD, I2S 48-QFN (7x7); Manufacturer: Asahi Kasei Microdevices/AKM; Name Component: Audio ADC; Operation Temperature: -40°C ~ 105°C; Power (V/A): 1.8V, 5V; Library Path 1: Integrated Circuit.SchLib; Part Number: AK5572EN; Value: AK5572EN; Package/Case: 48-QFN (7x7); Manufacturer P/N: AK5572EN; Supplier 1: Digi-key; Supplier Part Number 1: 974-1116-2-ND; ComponentLink1Description: Datasheet; ComponentLink1URL: https://www.akm.com/content/dam/documents/products/audio/audio-adc/ak5572en/ak5572en-en-datasheet.pdf
R50 R60 R70 R74 = 33 k  R0603: RES SMD 33 k OHM  ±1% 1/10W 0603; Power Rating: 0.1W; Name Component: Resistror; Operation Temperature: -55℃ to 155℃; Temperature Coefficient: ±100 ppm/°C; Library Path 1: Resistor.SchLib; Part Number: 33 k  R0603; Value: 33 k; Tolerance: ±1%
R51 R53 R75 R76 = 4.7 k  R0603: RES SMD 4.7 k OHM  ±1% 1/10W 0603; Power Rating: 0.1W; Name Component: Resistror; Operation Temperature: -55℃ to 155℃; Temperature Coefficient: ±100 ppm/°C; Library Path 1: Resistor.SchLib; Part Number: 4.7 k  R0603; Value: 4.7 k; Tolerance: ±1%
R52 R57 R59 R65 R69 R71 R73 R79 = 10  R0603: RES SMD 10 OHM  ±1% 1/10W 0603; Power Rating: 0.1W; Name Component: Resistror; Operation Temperature: -55℃ to 155℃; Temperature Coefficient: ±200 ppm/°C; Library Path 1: Resistor.SchLib; Part Number: 10  R0603; Value: 10; Tolerance: ±1%
R54-R56 R61 R72 R77 = 10 k  R0603: RES SMD 10 k OHM  ±1% 1/10W 0603; Power Rating: 0.1W; Name Component: Resistror; Operation Temperature: -55℃ to 155℃; Temperature Coefficient: ±100 ppm/°C; Library Path 1: Resistor.SchLib; Part Number: 10 k  R0603; Value: 10 k; Tolerance: ±1%
R58 = 10 k  R0603: as R18 on sheet AMPURR; Part Number: 10 k  R0603; Tolerance: ±1%
R62-R64 R67 R94 R100 R104 R110 R113-R119 = 10 k  R0402: as R23 on sheet AMPURR; Part Number: 10 k  R0402; Value: 10 k; Tolerance: ±1%
R66 R78 = 100 k  R0603: as R20 on sheet AMPURR; Part Number: 100 k  R0603; Value: 100 k; Tolerance: ±1%
R80 = 100  R0402: RES SMD 100 OHM  ±1% 1/16W 0402; Power Rating: 0.063W; Name Component: Resistror; Operation Temperature: -55℃ to 155℃; Temperature Coefficient: ±100 ppm/°C; Library Path 1: Resistor.SchLib; Part Number: 100  R0402; Value: 100; Tolerance: ±1%

## Sheet POWER.SchDoc: =DocumentName
size 420 x 297 mm; Author: Kozyr.I; CompanyName: "AS Manufacturing" LLC; Organization: "AS Manufacturing" LLC; Address1: 5 Sklyarenka St.; Address2: Kyiv 04073; Address3: Ukraine; Address4: https://ajax.systems/en/; DocumentNumber: 6; Revision: v1.0.0; SheetNumber: 6; SheetTotal: 6; Product name: AMPURR; Head: AMPURR..v1.0.0; PCB_Designator: AMPURR..v1.0.0; Template_version: 1.0.1
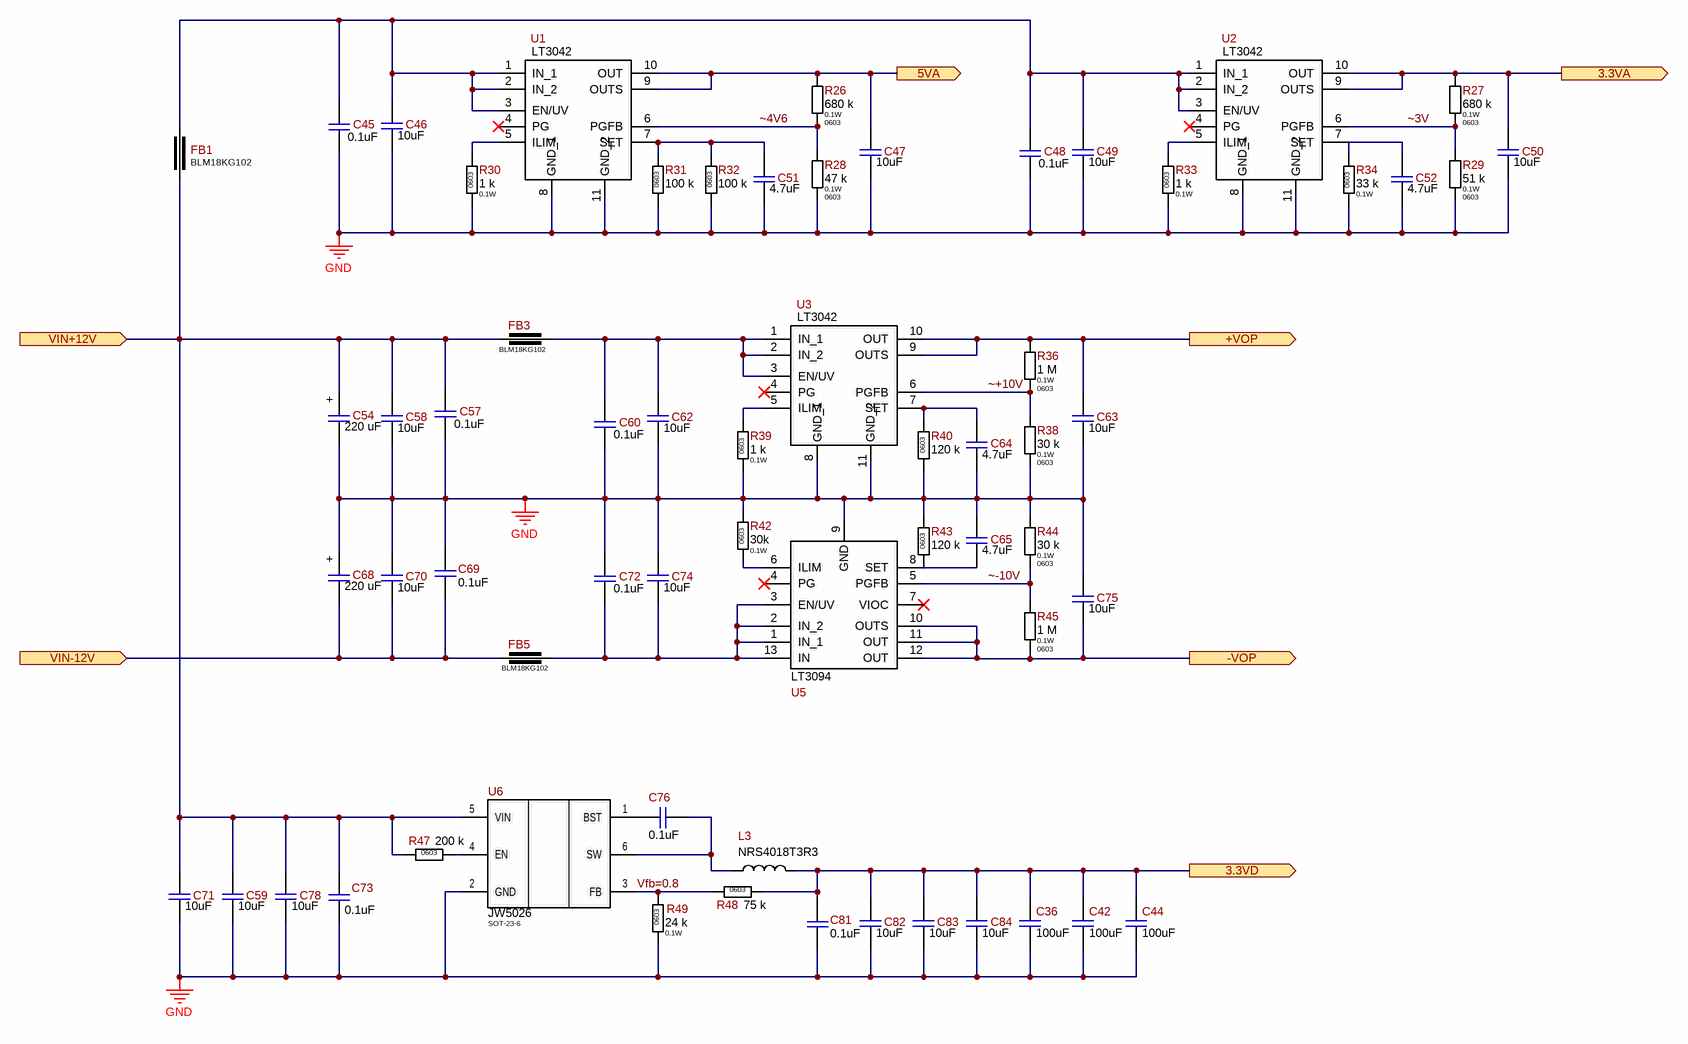
[diagram p2: POWER.SchDoc]

### Parts
C36  100uF  [C1206(3216)]
C42  100uF  [C1206(3216)]
C44  100uF  [C1206(3216)]
C45  0.1uF  [C0603(1608)]
C46  10uF  [C0805(2012)]
C47  10uF  [C0805(2012)]
C48  0.1uF  [C0603(1608)]
C49  10uF  [C0805(2012)]
C50  10uF  [C0805(2012)]
C51  4.7uF  [C0603(1608)]
C52  4.7uF  [C0603(1608)]
C54  220 uF  [CAP 8x9]
C57  0.1uF  [C0805(2012)]
C58  10uF  [C0805(2012)]
C59  10uF  [C0805(2012)]
C60  0.1uF  [C0603(1608)]
C62  10uF  [C0805(2012)]
C63  10uF  [C0805(2012)]
C64  4.7uF  [C0603(1608)]
C65  4.7uF  [C0603(1608)]
C68  220 uF  [CAP 8x9]
C69  0.1uF  [C0805(2012)]
C70  10uF  [C0805(2012)]
C71  10uF  [C0805(2012)]
C72  0.1uF  [C0603(1608)]
C73  0.1uF  [C0805(2012)]
C74  10uF  [C0805(2012)]
C75  10uF  [C0805(2012)]
C76  0.1uF  [C0603(1608)]
C78  10uF  [C0805(2012)]
C81  0.1uF  [C0805(2012)]
C82  10uF  [C0805(2012)]
C83  10uF  [C0805(2012)]
C84  10uF  [C0805(2012)]
FB1  BLM18KG102  [BLM18(0603)]
FB3  BLM18KG102  [BLM18(0603)]
FB5  BLM18KG102  [BLM18(0603)]
L3  NRS4018T3R3  [WE-LQS SMD 4018]
R26  680 k  Power Rating: 0.1W  Package/Case: 0603  [R0603]
R27  680 k  Power Rating: 0.1W  Package/Case: 0603  [R0603]
R28  47 k  Power Rating: 0.1W  Package/Case: 0603  [R0603]
R29  51 k  Power Rating: 0.1W  Package/Case: 0603  [R0603]
R30  1 k  Power Rating: 0.1W  Package/Case: 0603  [R0603]
R31  100 k  Package/Case: 0603  [R0603]
R32  100 k  Package/Case: 0603  [R0603]
R33  1 k  Power Rating: 0.1W  Package/Case: 0603  [R0603]
R34  33 k  Power Rating: 0.1W  Package/Case: 0603  [R0603]
R36  1 M  Power Rating: 0.1W  Package/Case: 0603  [R0603]
R38  30 k  Power Rating: 0.1W  Package/Case: 0603  [R0603]
R39  1 k  Power Rating: 0.1W  Package/Case: 0603  [R0603]
R40  120 k  Package/Case: 0603  [R0603]
R42  30k  Power Rating: 0.1W  Package/Case: 0603  [R0603]
R43  120 k  Package/Case: 0603  [R0603]
R44  30 k  Power Rating: 0.1W  Package/Case: 0603  [R0603]
R45  1 M  Power Rating: 0.1W  Package/Case: 0603  [R0603]
R47  200 k  Package/Case: 0603  [R0603]
R48  75 k  Package/Case: 0603  [R0603]
R49  24 k  Power Rating: 0.1W  Package/Case: 0603  [R0603]
U1  LT3042  [MSOP-10-EP]
U2  LT3042  [MSOP-10-EP]
U3  LT3042  [MSOP-10-EP]
U5  LT3094  [DFN-12]
U6  JW5026  Package: SOT-23-6  [SOT23-6]

### Ports
3.3VA (out), 3.3VD (out), 5VA (out), +VOP (out), -VOP (out), VIN+12V (in), VIN-12V (in)

### Nets
12V0: C54.1 C57.2 C58.1 C59.1 C71.1 C73.2 C78.1 FB1.1 FB3.1 R47.1 U6.5(VIN) ; port VIN+12V
+3.3VA: C50.1 R27.2 U2.9(OUTS) U2.10(OUT) ; port 3.3VA
+3.3VD: C36.1 C42.1 C44.1 C81.2 C82.1 C83.1 C84.1 L3.2 R48.2 ; port 3.3VD
+5VA: C47.1 R26.2 U1.9(OUTS) U1.10(OUT) ; port 5VA
+12VOP: C63.1 R36.1 U3.9(OUTS) U3.10(OUT) ; port +VOP
-12V0: C68.2 C69.1 C70.2 FB5.1 ; port VIN-12V
-12VOP: C75.2 R45.2 U5.10(OUTS) U5.11(OUT) U5.12(OUT) ; port -VOP
GND: C36.2 C42.2 C44.2 C45.1 C46.2 C47.2 C48.1 C49.2 C50.2 C51.2 C52.2 C54.2 C57.1 C58.2 C59.2 C60.1 C62.2 C63.2 C64.2 C65.1 C68.1 C69.2 C70.1 C71.2 C72.2 C73.1 C74.1 C75.1 C78.2 C81.1 C82.2 C83.2 C84.2 R28.1 R29.1 R30.1 R31.1 R32.1 R33.1 R34.1 R38.2 R39.1 R40.1 R42.2 R43.2 R44.1 R49.1 U1.8(GND_1) U1.11(GND_2) U2.8(GND_1) U2.11(GND_2) U3.8(GND_1) U3.11(GND_2) U5.9(GND) U6.2(GND)
Vfb=0.8: R48.1 R49.2 U6.3(FB)
~3V: R27.1 R29.2 U2.6(PGFB)
~4V6: R26.1 R28.2 U1.6(PGFB)
~+10V: R36.2 R38.1 U3.6(PGFB)
~-10V: R44.2 R45.1 U5.5(PGFB)
NetC45_2: C45.2 C46.1 C48.2 C49.1 FB1.2 U1.1(IN_1) U1.2(IN_2) U1.3(EN/UV) U2.1(IN_1) U2.2(IN_2) U2.3(EN/UV)
NetC51_1: C51.1 R31.2 R32.2 U1.7(SET)
NetC52_1: C52.1 R34.2 U2.7(SET)
NetC60_2: C60.2 C62.1 FB3.2 U3.1(IN_1) U3.2(IN_2) U3.3(EN/UV)
NetC64_1: C64.1 R40.2 U3.7(SET)
NetC65_2: C65.2 R43.1 U5.8(SET)
NetC72_1: C72.1 C74.2 FB5.2 U5.1(IN_1) U5.2(IN_2) U5.3(EN/UV) U5.13(IN)
NetC76_1: C76.1 U6.1(BST)
NetC76_2: C76.2 L3.1 U6.6(SW)
NetR30_2: R30.2 U1.5(ILIM)
NetR33_2: R33.2 U2.5(ILIM)
NetR39_2: R39.2 U3.5(ILIM)
NetR42_1: R42.1 U5.6(ILIM)
NetR47_2: R47.2 U6.4(EN)

Not connected (* = marked no-connect by the designer): U1 4(PG)*; U2 4(PG)*; U3 4(PG)*; U5 4(PG)* 7(VIOC)*

### Notes on the sheet
- Vout=0.1xR
- 1
- 2
- 3
- 4
- 5
- 6
- 7
- 8
- A
- B
- C
- D
- E
- F
- Назва проекту
- Мова
- UA
- Розробник
- Формат
- A3
- Версія
- Дата
- Лист
- /
- (in symbol 220 uF  16V 8 x 9) +

### Library data of the parts
C36 C42 C44 = 100uF  10V С1206: as C105 on sheet ADC_AK5572; Part Number: 100uF  10V С1206; Value: 100uF; Power (V/A): 10V; Package/Case: С1206; Supplier 1: Digi-key; ComponentLink1Description: Datasheet
C45 C48 C60 C72 C76 = 0.1uF  50V C0603: as C92 on sheet ADC_AK5572; Part Number: 0.1uF  50V C0603; Value: 0.1uF; Temperature Coefficient: X7R; Power (V/A): 50V; Package/Case: C0603; Supplier 1: Digi-key; Supplier Part Number 1: 1276-6854-2-ND; ComponentLink1Description: Datasheet; ComponentLink1URL: https://www.samsungsem.com/resources/file/global/support/product_catalog/MLCC.pdf
C46 C47 C49 C50 C58 C59 C62 C63 C70 C71 C74 C75 C78 C82-C84 = 10uF  25V C0805: CAP CER 10UF 25V X5R 0805; Manufacturer: Murata Electronics North America; Manufacturer P/N: GRM21BR61E106KA73L; Name Component: Capacitor Ceramic; Tolerance: ±10%; Operation Temperature: -55°C ~ 105°C; Library Path 1: Capacitors.SchLib; Notes: GRM21BR61E106KA73K, 08053D106KAT2A; Part Number: 10uF  25V C0805; Value: 10uF; Temperature Coefficient: X5R; Power (V/A): 25V; Package/Case: C0805; Supplier 1: Digi-key; Supplier Part Number 1: 490-5523-2-ND; ComponentLink1Description: Datasheet; ComponentLink1URL: https://www.murata.com/~/media/webrenewal/support/library/catalog/products/capacitor/mlcc/c02e.ashx?la=en-us
C51 C52 C64 C65 = 4.7uF  25V C0603: CAP CER 4.7UF 25V X6S 0603; Manufacturer: Murata Electronics North America; Manufacturer P/N: GRM188C81E475KE11D; Name Component: Capacitor Ceramic; Tolerance: ±10%; Operation Temperature: -55°C ~ 105°C; Library Path 1: Capacitors.SchLib; Notes: GRM188C81E475KE11J; Part Number: 4.7uF  25V C0603; Value: 4.7uF; Temperature Coefficient: X6S; Power (V/A): 25V; Package/Case: C0603; Supplier 1: Digi-key; Supplier Part Number 1: 490-7199-2-ND; ComponentLink1Description: Datasheet; ComponentLink1URL: https://www.murata.com/~/media/webrenewal/support/library/catalog/products/capacitor/mlcc/c02e.ashx?la=en-us
C54 C68 = 220 uF  16V 8 x 9: CAP POLY 220 UF 20% 16V 8x9; Manufacturer: Leaguer; Manufacturer P/N: VPT1C221M0809; Name Component: Conductive Polymer Aluminum Solid Capacitors; Operation Temperature: -55°C ~ 105°C; Library Path 1: Capacitors.SchLib; Part Number: 220 uF  16V 8 x 9; Value: 220 uF; Tolerance: ±20%; Temperature Coefficient: -; Power (V/A): 16V; Package/Case: 8 x 9; Supplier 1: RCS; Supplier Part Number 1: 124733; ComponentLink1Description: Datasheet; ComponentLink1URL: https://www.rcscomponents.kiev.ua/datasheets/kks4700608x9-datasheet.pdf
C57 C69 C73 C81 = 0.1uF  50V C0805: CAP CER 0.1UF 50V X7R 0805; Manufacturer: AVX Corporation; Manufacturer P/N: 08055C104KAT2A; Name Component: Capacitor Ceramic; Tolerance: ±10%; Operation Temperature: -55°C ~ 105°C; Notes: 08055C104KAT4A,08055C104KAJ2A, 08055C104KAJ4A; Library Path 1: Capacitors.SchLib; Part Number: 0.1uF  50V C0805; Value: 0.1uF; Temperature Coefficient: X7R; Power (V/A): 50V; Package/Case: C0805; Supplier 1: Digi-key; Supplier Part Number 1: 478-1395-2-ND; ComponentLink1Description: Datasheet; ComponentLink1URL: http://catalogs.avx.com/SurfaceMount.pdf
FB1 FB3 FB5 = BLM18KG102: FERRITE BEAD 1 KOHM 0603 1LN; Manufacturer: Murata Electronics North America; Manufacturer P/N: BLM18KG102SN1D; Name Component: Ferrite Beads; Tolerance: ±25%; Power (V/A): 1A; Library Path 1: Inductance.SchLib; Part Number: BLM18KG102; Value: BLM18KG102; Package/Case: 0603 (1608 Metric); Supplier 1: Digi-key; Supplier Part Number 1: 490-17349-2-ND; ComponentLink1Description: Datasheet; ComponentLink1URL: https://media.digikey.com/pdf/Data%20Sheets/Murata%20PDFs/BLM18yyyyyyN1x.pdf
L3 = NRS4018T3R3: FIXED IND 3.3UH 2A 66 MOHM SMD; Manufacturer: TaiyoYuden; Manufacturer P/N: NRS4018T3R3MDGJ; Name Component: Fixed Inductors; Tolerance: ±20; Operation Temperature: -25°C ~ 120°C; Library Path 1: Inductance.SchLib; Part Number: NRS4018T3R3; Value: NRS4018T3R3; Power (V/A): 2A; Package/Case: 4.00mm x 4.00mm; Supplier 1: Digi-key; Supplier Part Number 1: 587-2892-2-ND; ComponentLink1Description: Datasheet; ComponentLink1URL: https://www.yuden.co.jp/productdata/catalog/wound04_e.pdf
R26 R27 = 680 k  R0603: RES SMD 680 k OHM  ±1% 1/10W 0603; Name Component: Resistror; Operation Temperature: -55℃ to 155℃; Temperature Coefficient: ±100 ppm/°C; Library Path 1: Resistor.SchLib; Part Number: 680 k  R0603; Value: 680 k; Tolerance: ±1%
R28 = 47 k  R0603: RES SMD 47 k OHM  ±1% 1/10W 0603; Name Component: Resistror; Operation Temperature: -55℃ to 155℃; Temperature Coefficient: ±100 ppm/°C; Library Path 1: Resistor.SchLib; Part Number: 47 k  R0603; Value: 47 k; Tolerance: ±1%
R29 = 51 k  R0603: RES SMD 51 k OHM  ±1% 1/10W 0603; Name Component: Resistror; Operation Temperature: -55℃ to 155℃; Temperature Coefficient: ±100 ppm/°C; Library Path 1: Resistor.SchLib; Part Number: 51 k  R0603; Value: 51 k; Tolerance: ±1%
R30 R33 R39 = 1 k  R0603: RES SMD 1 k OHM  ±1% 1/10W 0603; Name Component: Resistror; Operation Temperature: -55℃ to 155℃; Temperature Coefficient: ±100 ppm/°C; Library Path 1: Resistor.SchLib; Part Number: 1 k  R0603; Value: 1 k; Tolerance: ±1%
R31 R32 = 100 k  R0603: RES SMD 100 k OHM  ±1% 1/10W 0603; Power Rating: 0.1W; Name Component: Resistror; Operation Temperature: -55℃ to 155℃; Temperature Coefficient: ±100 ppm/°C; Library Path 1: Resistor.SchLib; Part Number: 100 k  R0603; Value: 100 k; Tolerance: ±1%
R34 = 33 k  R0603: RES SMD 33 k OHM  ±1% 1/10W 0603; Name Component: Resistror; Operation Temperature: -55℃ to 155℃; Temperature Coefficient: ±100 ppm/°C; Library Path 1: Resistor.SchLib; Part Number: 33 k  R0603; Value: 33 k; Tolerance: ±1%
R36 R45 = 1 M  R0603: RES SMD 1 M OHM  ±1% 1/10W 0603; Name Component: Resistror; Operation Temperature: -55℃ to 155℃; Temperature Coefficient: ±100 ppm/°C; Library Path 1: Resistor.SchLib; Part Number: 1 M  R0603; Value: 1 M; Tolerance: ±1%
R38 R44 = 30 k  R0603: RES SMD 30 k OHM  ±1% 1/10W 0603; Name Component: Resistror; Operation Temperature: -55℃ to 155℃; Temperature Coefficient: ±100 ppm/°C; Library Path 1: Resistor.SchLib; Part Number: 30 k  R0603; Value: 30 k; Tolerance: ±1%
R40 R43 = 120 k  R0603: RES SMD 120 k OHM  ±1% 1/10W 0603; Power Rating: 0.1W; Name Component: Resistror; Operation Temperature: -55℃ to 155℃; Temperature Coefficient: ±100 ppm/°C; Library Path 1: Resistor.SchLib; Part Number: 120 k  R0603; Value: 120 k; Tolerance: ±1%
R42 = 120 k  R0603: RES SMD 120 k OHM  ±1% 1/10W 0603; Name Component: Resistror; Value: 120 k; Operation Temperature: -55℃ to 155℃; Temperature Coefficient: ±100 ppm/°C; Library Path 1: Resistor.SchLib; Part Number: 120 k  R0603; Tolerance: ±1%
R47 = 200 k  R0603: RES SMD 200 k OHM  ±1% 1/10W 0603; Power Rating: 0.1W; Name Component: Resistror; Operation Temperature: -55℃ to 155℃; Temperature Coefficient: ±100 ppm/°C; Library Path 1: Resistor.SchLib; Part Number: 200 k  R0603; Value: 200 k; Tolerance: ±1%
R48 = 75 k  R0603: RES SMD 75 k OHM  ±1% 1/10W 0603; Power Rating: 0.1W; Name Component: Resistror; Operation Temperature: -55℃ to 155℃; Temperature Coefficient: ±100 ppm/°C; Library Path 1: Resistor.SchLib; Part Number: 75 k  R0603; Value: 75 k; Tolerance: ±1%
R49 = 24 k  R0603: RES SMD 24 k OHM  ±1% 1/10W 0603; Name Component: Resistror; Operation Temperature: -55℃ to 155℃; Temperature Coefficient: ±100 ppm/°C; Library Path 1: Resistor.SchLib; Part Number: 24 k  R0603; Value: 24 k; Tolerance: ±1%
U1-U3 = LT3042: Linear Voltage Regulator IC Positive Adjustable 1 Output 200mA 10-MSOP-EP 117dB ~ 56dB (120Hz ~ 10MHz); Manufacturer_Name: Analog Devices; Manufacturer_Part_Number: LT3042IMSE#PBF; Operation Temperature: -40°C ~ 125°C (TJ); Power (V/A): 2 - 20V; Library Path 1: Power converters.SchLib; ComponentDescription: Linear Voltage Regulator LT3042  (10-MSOP-EP); Datasheet Link: https://www.analog.com/media/en/technical-documentation/data-sheets/3042fb.pdf; Height: 1.1mm; Mouser Part Number: 584-LT3042IMSE#PBF; Mouser Price/Stock: https://www.mouser.co.uk/ProductDetail/Analog-Devices/LT3042IMSEPBF?qs=oahfZPh6IAKNLbWsEo0jgA%3D%3D; Arrow Part Number: LT3042IMSE#PBF; Arrow Price/Stock: https://www.arrow.com/en/products/lt3042imsepbf/analog-devices?utm_currency=USD&region=europe; Part Number: LT3042; Name Component: Linear Voltage Regulator; Value: LT3042; Package/Case: 10-MSOP-EP; Supplier 1: Digi-key; Supplier Part Number 1: LT3042IMSE#PBF; ComponentLink1Description: Datasheet; ComponentLink1URL: https://www.analog.com/media/en/technical-documentation/data-sheets/3042fb.pdf
U5 = LT3094: Linear Voltage Regulator IC Negative Adjustable 1 Output 500mA 12-DFN (3x3) 108dB ~ 28dB (120Hz ~ 10MHz); Manufacturer_Name: Analog Devices; Manufacturer_Part_Number: LT3042IMSE#PBF; Manufacturer: Analog Devices Inc.; Manufacturer P/N: LT3094EDD#TRPBF; Operation Temperature: -40°C ~ 125°C (TJ); Power (V/A): -2.3…-19.4V; Library Path 1: Power converters.SchLib; ComponentDescription: Linear Voltage Regulator LT3094  (12-DFN (3x3)); Datasheet Link: https://www.analog.com/media/en/technical-documentation/data-sheets/3042fb.pdf; Height: 1.1mm; Mouser Part Number: 584-LT3042IMSE#PBF; Mouser Price/Stock: https://www.mouser.co.uk/ProductDetail/Analog-Devices/LT3042IMSEPBF?qs=oahfZPh6IAKNLbWsEo0jgA%3D%3D; Arrow Part Number: LT3042IMSE#PBF; Arrow Price/Stock: https://www.arrow.com/en/products/lt3042imsepbf/analog-devices?utm_currency=USD&region=europe; Part Number: LT3094; Name Component: Linear Voltage Regulator; Value: LT3094; Package/Case: 12-DFN (3x3); Supplier 1: Digi-key; Supplier Part Number 1: 505-LT3094EDD#TRPBFTR-ND; ComponentLink1Description: Datasheet; ComponentLink1URL: https://www.analog.com/media/en/technical-documentation/data-sheets/LT3094.pdf
U6 = JW5026: Switching Voltage Regulators 4.7V to 40V Input, 1A Output , Vfb = 0.6V VStep-Down Converter SOT-23-6; Manufacturer: Joulwatt Technology; Name Component: Power converters; Operation Temperature: -40°C ~ 125°C (TJ); Power (V/A): 4.7…40V 2A; Library Path 1: Power converters.SchLib; ComponentDescription: Power converters JW5026  (SOT 23-6); ComponentLink1URL: https://www.skytech.ir/DownLoad/File/2588_JW5026.pdf; ComponentLink1Description: Datasheet; Part Number: JW5026; Value: JW5026; Package/Case: SOT 23-6; Supplier 1: Kosmodrom; Supplier Part Number 1: JW5026